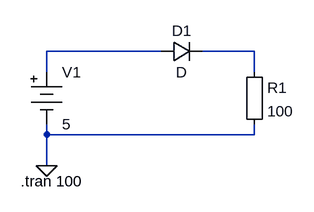
[diagram p0: schematic DC-BDR-krets1.asc]
DC-BDR-krets1.asc, the LTspice schematic file:
Version 4
SHEET 1 880 680
WIRE 256 32 80 32
WIRE 400 32 320 32
WIRE 80 64 80 32
WIRE 400 64 400 32
WIRE 80 160 80 144
WIRE 400 160 400 144
WIRE 400 160 80 160
WIRE 80 208 80 160
FLAG 80 208 0
SYMBOL diode 256 48 R270
WINDOW 0 32 32 VTop 2
WINDOW 3 0 32 VBottom 2
SYMATTR InstName D1
SYMBOL Misc\\battery 80 48 R0
WINDOW 123 0 0 Left 0
WINDOW 39 0 0 Left 0
SYMATTR InstName V1
SYMATTR Value 5
SYMBOL Misc\\EuropeanResistor 384 48 R0
SYMATTR InstName R1
SYMATTR Value 100
TEXT 40 232 Left 2 !.tran 100

The netlist it stands for:
* DC-BDR-krets1.asc
D1 N001 N002 D
V1 N001 0 5
R1 N002 0 100
.model D D
.lib standard.dio
.tran 100
.backanno
.end